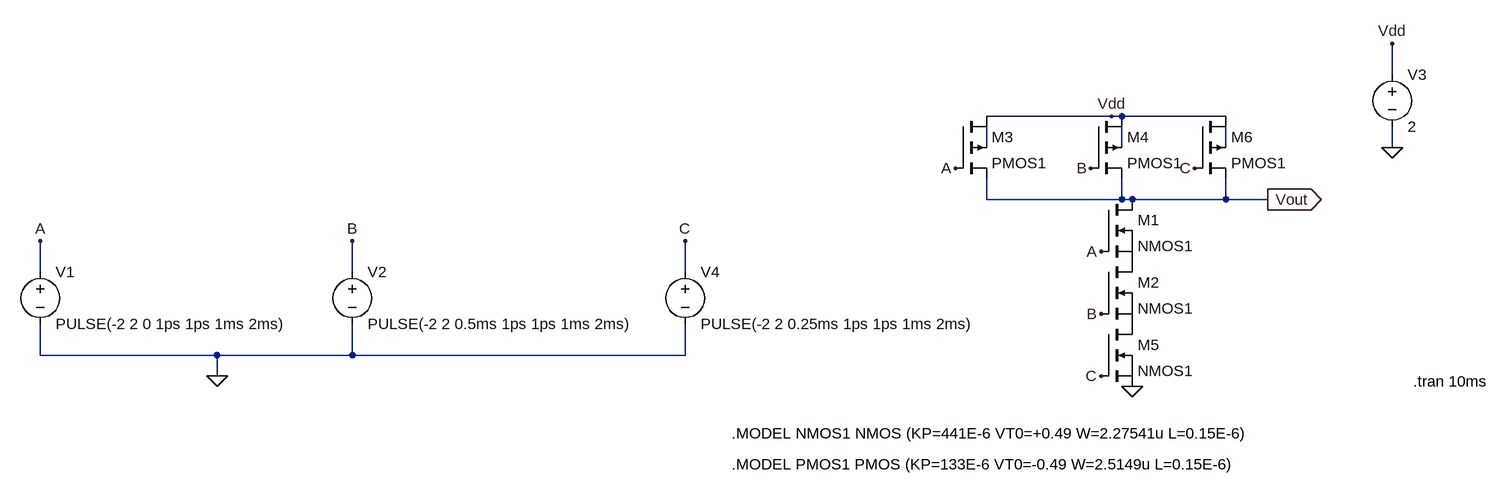
[diagram p0: schematic nand3.asc]
nand3.asc, the LTspice schematic file:
Version 4
SHEET 1 880 680
WIRE 672 -128 672 -176
WIRE 240 -64 48 -64
WIRE 256 -64 240 -64
WIRE 416 -64 256 -64
WIRE 48 -16 48 -48
WIRE 256 -16 256 -48
WIRE 416 -16 416 -48
WIRE 672 -16 672 -48
WIRE 48 64 48 32
WIRE 256 64 256 32
WIRE 256 64 48 64
WIRE 272 64 256 64
WIRE 416 64 416 32
WIRE 416 64 272 64
WIRE 480 64 416 64
WIRE -1408 176 -1408 128
WIRE -928 176 -928 128
WIRE -416 176 -416 128
WIRE -1408 304 -1408 256
WIRE -1136 304 -1408 304
WIRE -928 304 -928 256
WIRE -928 304 -1136 304
WIRE -416 304 -416 256
WIRE -416 304 -928 304
WIRE -1136 336 -1136 304
FLAG 272 352 0
FLAG -1408 128 A
FLAG 224 144 A
FLAG 0 16 A
FLAG -928 128 B
FLAG 224 240 B
FLAG 208 16 B
FLAG 672 -176 Vdd
FLAG 240 -64 Vdd
FLAG 480 64 Vout
IOPIN 480 64 Out
FLAG -1136 336 0
FLAG 672 -16 0
FLAG 224 336 C
FLAG 368 16 C
FLAG -416 128 C
SYMBOL nmos 224 64 R0
SYMATTR InstName M1
SYMATTR Value NMOS1
SYMBOL nmos 224 160 R0
SYMATTR InstName M2
SYMATTR Value NMOS1
SYMBOL pmos4 0 -64 R0
SYMATTR InstName M3
SYMATTR Value PMOS1
SYMBOL pmos4 208 -64 R0
SYMATTR InstName M4
SYMATTR Value PMOS1
SYMBOL voltage -1408 160 R0
WINDOW 123 0 0 Left 0
WINDOW 39 0 0 Left 0
SYMATTR InstName V1
SYMATTR Value PULSE(-2 2 0 1ps 1ps 1ms 2ms)
SYMBOL voltage -928 160 R0
WINDOW 123 0 0 Left 0
WINDOW 39 0 0 Left 0
SYMATTR InstName V2
SYMATTR Value PULSE(-2 2 0.5ms 1ps 1ps 1ms 2ms)
SYMBOL voltage 672 -144 R0
WINDOW 123 0 0 Left 0
WINDOW 39 0 0 Left 0
SYMATTR InstName V3
SYMATTR Value 2
SYMBOL nmos 224 256 R0
SYMATTR InstName M5
SYMATTR Value NMOS1
SYMBOL pmos4 368 -64 R0
SYMATTR InstName M6
SYMATTR Value PMOS1
SYMBOL voltage -416 160 R0
WINDOW 123 0 0 Left 0
WINDOW 39 0 0 Left 0
SYMATTR InstName V4
SYMATTR Value PULSE(-2 2 0.25ms 1ps 1ps 1ms 2ms)
TEXT -344 424 Left 2 !.MODEL NMOS1 NMOS (KP=441E-6 VT0=+0.49 W=2.27541u L=0.15E-6)
TEXT -344 472 Left 2 !.MODEL PMOS1 PMOS (KP=133E-6 VT0=-0.49 W=2.5149u L=0.15E-6)
TEXT 704 344 Left 2 !.tran 10ms

The netlist it stands for:
* nand3.asc
M1 Vout A P001 P001 NMOS1
M2 P001 B P002 P002 NMOS1
M3 Vdd A Vout N001 PMOS1
M4 Vdd B Vout N002 PMOS1
V1 A 0 PULSE(-2 2 0 1ps 1ps 1ms 2ms)
V2 B 0 PULSE(-2 2 0.5ms 1ps 1ps 1ms 2ms)
V3 Vdd 0 2
M5 P002 C 0 0 NMOS1
M6 Vdd C Vout N003 PMOS1
V4 C 0 PULSE(-2 2 0.25ms 1ps 1ps 1ms 2ms)
.model NMOS NMOS
.model PMOS PMOS
.lib standard.mos
.MODEL NMOS1 NMOS (KP=441E-6 VT0=+0.49 W=2.27541u L=0.15E-6)
.MODEL PMOS1 PMOS (KP=133E-6 VT0=-0.49 W=2.5149u L=0.15E-6)
.tran 10ms
.backanno
.end